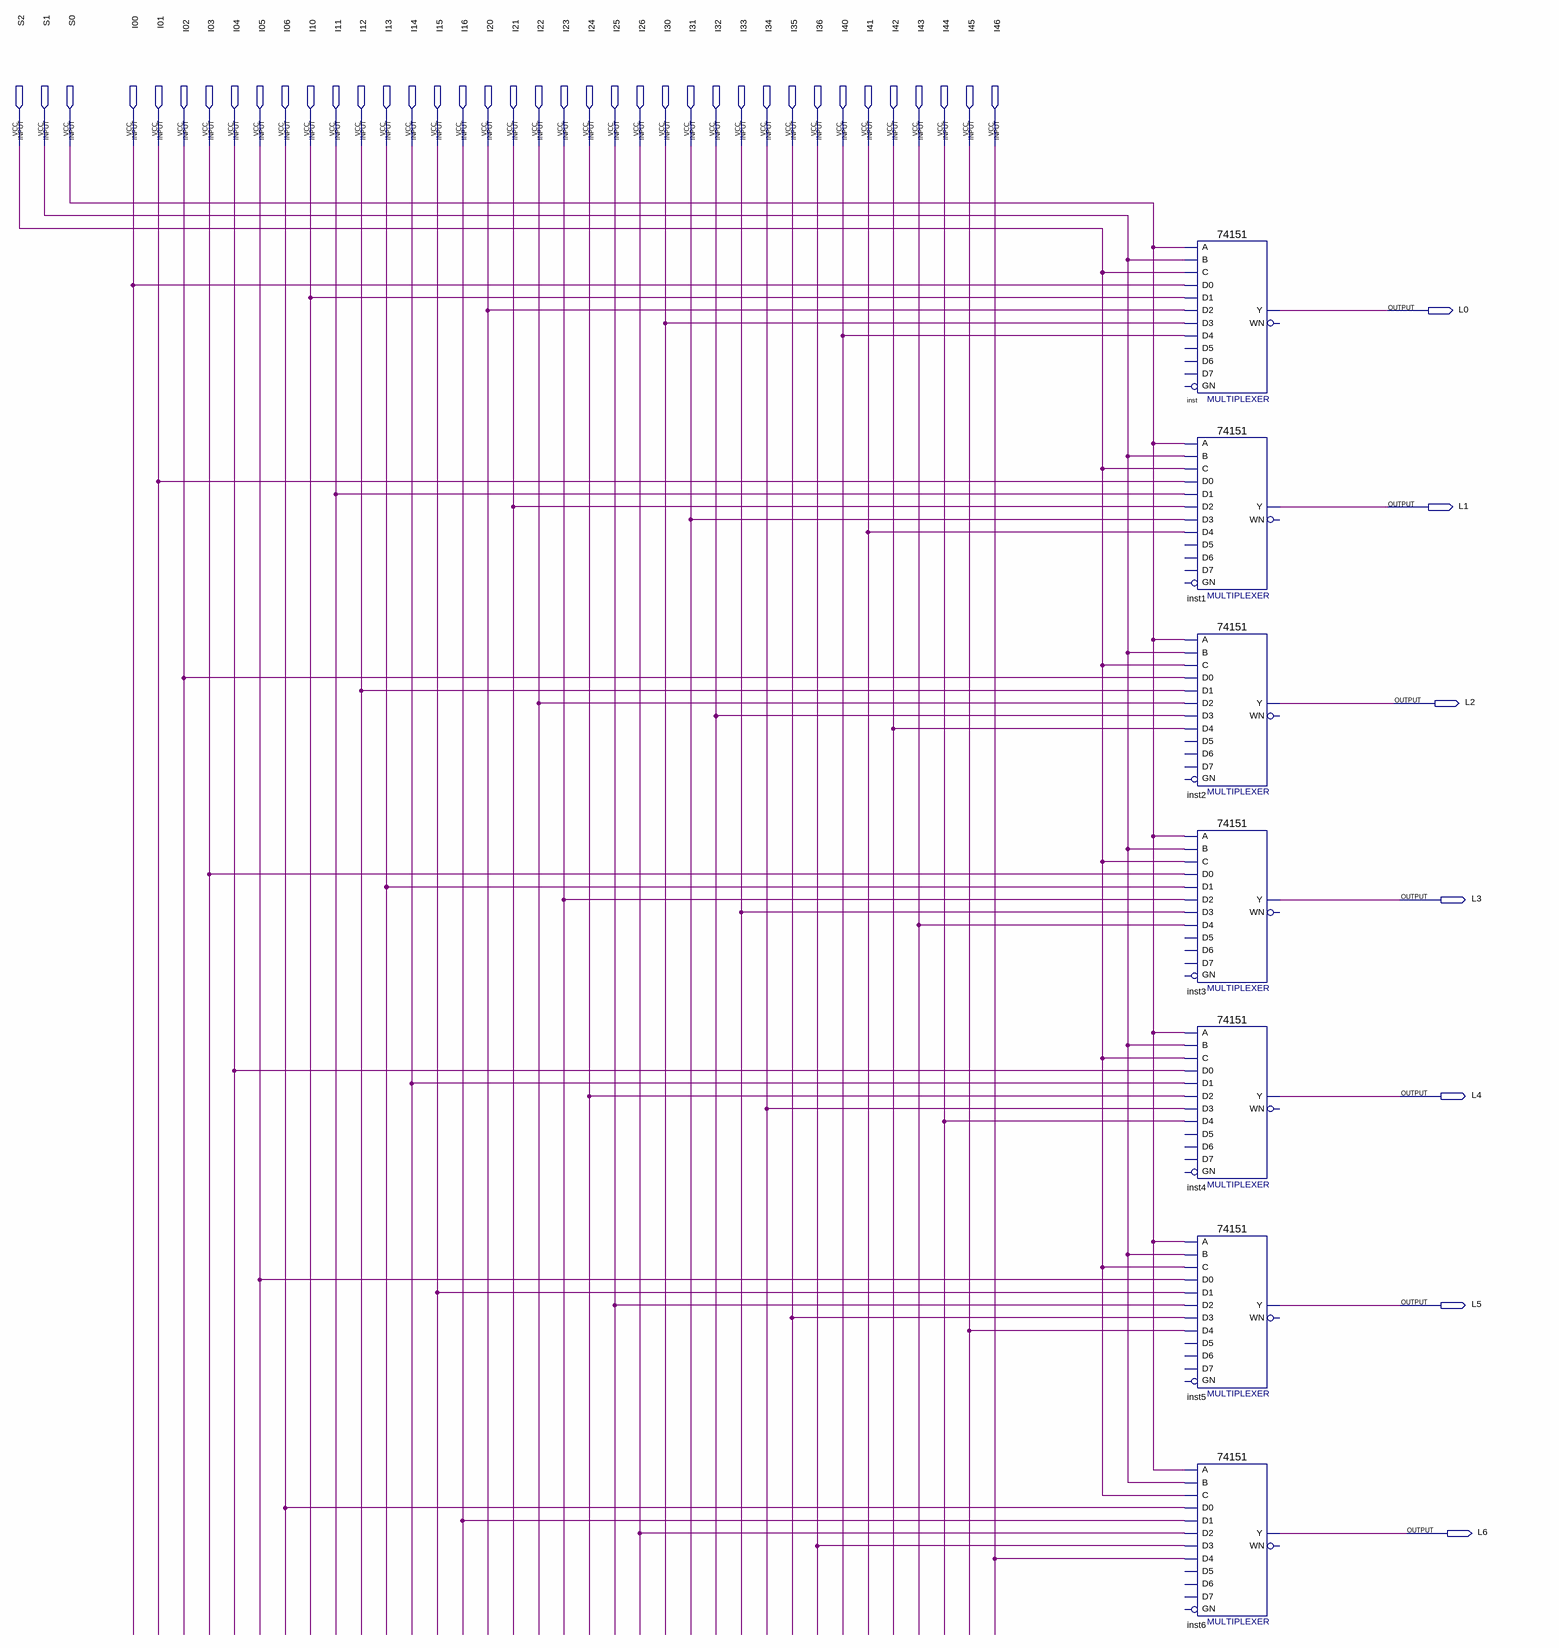
[diagram p0: schematic sheet]
// Quartus schematic multiplexador-35-7.bdf as structural Verilog: 7 symbols, 45 pins
module \multiplexador-35-7  (
  input  S2,
  input  S1,
  input  S0,
  input  I00,
  input  I01,
  input  I02,
  input  I03,
  input  I04,
  input  I05,
  input  I06,
  input  I10,
  input  I11,
  input  I12,
  input  I13,
  input  I14,
  input  I15,
  input  I16,
  input  I20,
  input  I21,
  input  I22,
  input  I23,
  input  I24,
  input  I25,
  input  I26,
  input  I30,
  input  I31,
  input  I32,
  input  I33,
  input  I34,
  input  I35,
  input  I36,
  input  I40,
  input  I41,
  input  I42,
  input  I43,
  input  I44,
  input  I45,
  input  I46,
  output L0,
  output L1,
  output L2,
  output L3,
  output L4,
  output L5,
  output L6
);

  \74151  inst (
    .C(S2), .B(S1), .A(S0), .D0(I00), .D1(I10), .D4(I40), .D3(I30), .D2(I20), .Y(L0));  // open: GN, D5, D6, D7, WN
  \74151  inst1 (
    .C(S2), .B(S1), .A(S0), .D0(I01), .D1(I11), .D4(I41), .D3(I31), .D2(I21), .Y(L1));  // open: GN, D5, D6, D7, WN
  \74151  inst2 (
    .C(S2), .B(S1), .A(S0), .D0(I02), .D1(I12), .D4(I42), .D3(I32), .D2(I22), .Y(L2));  // open: GN, D5, D6, D7, WN
  \74151  inst3 (
    .C(S2), .B(S1), .A(S0), .D0(I03), .D1(I13), .D4(I43), .D3(I33), .D2(I23), .Y(L3));  // open: GN, D5, D6, D7, WN
  \74151  inst4 (
    .C(S2), .B(S1), .A(S0), .D0(I04), .D1(I14), .D4(I44), .D3(I34), .D2(I24), .Y(L4));  // open: GN, D5, D6, D7, WN
  \74151  inst5 (
    .C(S2), .B(S1), .A(S0), .D0(I05), .D1(I15), .D4(I45), .D3(I35), .D2(I25), .Y(L5));  // open: GN, D5, D6, D7, WN
  \74151  inst6 (
    .C(S2), .B(S1), .A(S0), .D0(I06), .D1(I16), .D4(I46), .D3(I36), .D2(I26), .Y(L6));  // open: GN, D5, D6, D7, WN
endmodule
